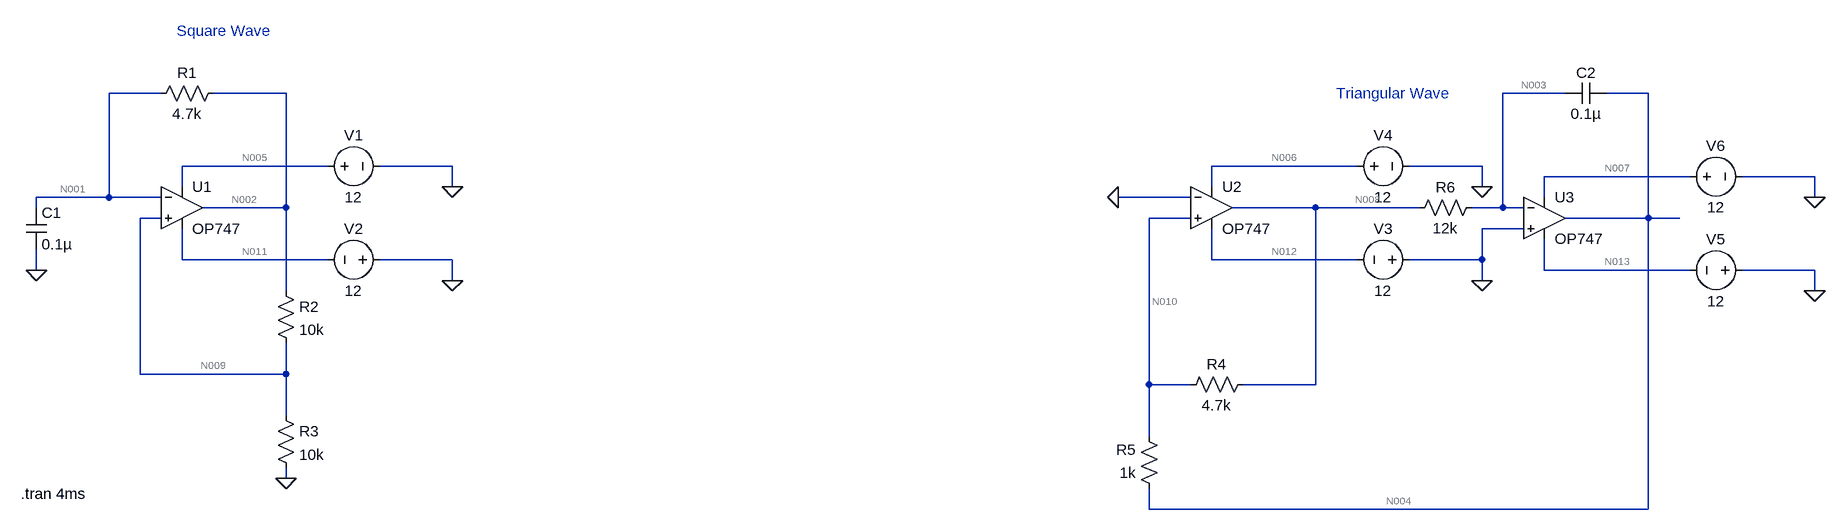
[diagram p0: schematic Square_wave_generator.asc]
Square_wave_generator.asc, the LTspice schematic file:
Version 4
SHEET 1 2580 680
WIRE 16 -64 -64 -64
WIRE 208 -64 96 -64
WIRE 2176 -64 2080 -64
WIRE 2304 -64 2240 -64
WIRE 272 48 48 48
WIRE 464 48 352 48
WIRE 1856 48 1632 48
WIRE 2048 48 1936 48
WIRE 2368 64 2144 64
WIRE 2560 64 2448 64
WIRE 48 80 48 48
WIRE 464 80 464 48
WIRE 1632 80 1632 48
WIRE 2048 80 2048 48
WIRE -64 96 -64 -64
WIRE -64 96 -176 96
WIRE 16 96 -64 96
WIRE 1600 96 1488 96
WIRE 2144 96 2144 64
WIRE 2560 96 2560 64
WIRE -176 112 -176 96
WIRE 208 112 208 -64
WIRE 208 112 80 112
WIRE 1792 112 1664 112
WIRE 1952 112 1792 112
WIRE 2080 112 2080 -64
WIRE 2080 112 2032 112
WIRE 2112 112 2080 112
WIRE 16 128 -16 128
WIRE 1600 128 1536 128
WIRE 2304 128 2304 -64
WIRE 2304 128 2176 128
WIRE 2352 128 2304 128
WIRE 2112 144 2048 144
WIRE 48 192 48 144
WIRE 272 192 48 192
WIRE 464 192 352 192
WIRE 1632 192 1632 144
WIRE 1856 192 1632 192
WIRE 2048 192 2048 144
WIRE 2048 192 1936 192
WIRE -176 208 -176 176
WIRE 2144 208 2144 160
WIRE 2368 208 2144 208
WIRE 2560 208 2448 208
WIRE 464 224 464 192
WIRE 2048 224 2048 192
WIRE 208 240 208 112
WIRE 2560 240 2560 208
WIRE -16 368 -16 128
WIRE 208 368 208 320
WIRE 208 368 -16 368
WIRE 1536 384 1536 128
WIRE 1600 384 1536 384
WIRE 1792 384 1792 112
WIRE 1792 384 1680 384
WIRE 208 432 208 368
WIRE 1536 464 1536 384
WIRE 208 528 208 512
WIRE 1536 576 1536 544
WIRE 2304 576 2304 128
WIRE 2304 576 1536 576
FLAG 464 80 0
FLAG 464 224 0
FLAG -176 208 0
FLAG 208 528 0
FLAG 2048 80 0
FLAG 2048 224 0
FLAG 1488 96 0
FLAG 2560 96 0
FLAG 2560 240 0
SYMBOL voltage 256 48 R270
WINDOW 0 32 56 VTop 2
WINDOW 3 -32 56 VBottom 2
WINDOW 123 0 0 Left 0
WINDOW 39 0 0 Left 0
SYMATTR InstName V1
SYMATTR Value 12
SYMBOL voltage 368 192 R90
WINDOW 0 -32 56 VBottom 2
WINDOW 3 32 56 VTop 2
WINDOW 123 0 0 Left 0
WINDOW 39 0 0 Left 0
SYMATTR InstName V2
SYMATTR Value 12
SYMBOL OpAmps\\OP747 48 48 R0
SYMATTR InstName U1
SYMBOL cap -192 112 R0
SYMATTR InstName C1
SYMATTR Value 0.1µ
SYMBOL res 112 -80 R90
WINDOW 0 0 56 VBottom 2
WINDOW 3 32 56 VTop 2
SYMATTR InstName R1
SYMATTR Value 4.7k
SYMBOL res 192 224 R0
SYMATTR InstName R2
SYMATTR Value 10k
SYMBOL res 192 416 R0
SYMATTR InstName R3
SYMATTR Value 10k
SYMBOL voltage 1952 192 R90
WINDOW 0 -32 56 VBottom 2
WINDOW 3 32 56 VTop 2
WINDOW 123 0 0 Left 0
WINDOW 39 0 0 Left 0
SYMATTR InstName V3
SYMATTR Value 12
SYMBOL OpAmps\\OP747 1632 48 R0
SYMATTR InstName U2
SYMBOL res 1696 368 R90
WINDOW 0 0 56 VBottom 2
WINDOW 3 32 56 VTop 2
SYMATTR InstName R4
SYMATTR Value 4.7k
SYMBOL res 1552 560 R180
WINDOW 0 36 76 Left 2
WINDOW 3 36 40 Left 2
SYMATTR InstName R5
SYMATTR Value 1k
SYMBOL res 2048 96 R90
WINDOW 0 0 56 VBottom 2
WINDOW 3 32 56 VTop 2
SYMATTR InstName R6
SYMATTR Value 12k
SYMBOL voltage 1840 48 R270
WINDOW 0 32 56 VTop 2
WINDOW 3 -32 56 VBottom 2
WINDOW 123 0 0 Left 0
WINDOW 39 0 0 Left 0
SYMATTR InstName V4
SYMATTR Value 12
SYMBOL voltage 2464 208 R90
WINDOW 0 -32 56 VBottom 2
WINDOW 3 32 56 VTop 2
WINDOW 123 0 0 Left 0
WINDOW 39 0 0 Left 0
SYMATTR InstName V5
SYMATTR Value 12
SYMBOL OpAmps\\OP747 2144 64 R0
SYMATTR InstName U3
SYMBOL voltage 2352 64 R270
WINDOW 0 32 56 VTop 2
WINDOW 3 -32 56 VBottom 2
WINDOW 123 0 0 Left 0
WINDOW 39 0 0 Left 0
SYMATTR InstName V6
SYMATTR Value 12
SYMBOL cap 2240 -80 R90
WINDOW 0 0 32 VBottom 2
WINDOW 3 32 32 VTop 2
SYMATTR InstName C2
SYMATTR Value 0.1µ
TEXT -200 552 Left 2 !.tran 4ms
TEXT 40 -160 Left 2 ;Square Wave
TEXT 1824 -64 Left 2 ;Triangular Wave

The netlist it stands for:
* Square_wave_generator.asc
V1 N005 0 12
V2 0 N011 12
XU1 N009 N001 N005 N011 N002 OP747  ; pins In+ In- V+ V- OUT
C1 N001 0 0.1µ
R1 N002 N001 4.7k
R2 N002 N009 10k
R3 N009 0 10k
V3 0 N012 12
XU2 N010 0 N006 N012 N008 OP747  ; pins In+ In- V+ V- OUT
R4 N008 N010 4.7k
R5 N004 N010 1k
R6 N003 N008 12k
V4 N006 0 12
V5 0 N013 12
XU3 0 N003 N007 N013 N004 OP747  ; pins In+ In- V+ V- OUT
V6 N007 0 12
C2 N004 N003 0.1µ
.tran 4ms
* Square Wave
* Triangular Wave
.backanno
.end

* Results of the author's LTspice run, read from the files saved beside the schematic
* Operating Point, zero values left out:
*   V(n005) = 12 V
*   V(n011) = -12 V
*   V(n001) = 228.1 µV
*   V(n009) = 148.1 µV
*   V(n002) = 185.4 µV
*   V(n012) = -12 V
*   V(n006) = 12 V
*   V(n010) = -80 µV
*   V(n008) = -28.82 µV
*   V(n004) = -102 µV
*   V(n003) = 80 µV
*   V(n013) = -12 V
*   V(n007) = 12 V
*   I(R1) = -9.068 nA
*   I(R2) = 3.738 nA
*   I(R3) = 14.81 nA
*   I(R4) = 10.89 nA
*   I(R5) = -21.96 nA
*   I(R6) = 9.068 nA
*   I(V1) = -282.8 µA
*   I(V2) = -282.8 µA
*   I(V3) = -282.8 µA
*   I(V4) = -282.8 µA
*   I(V5) = -282.8 µA
*   I(V6) = -282.8 µA
*   Ix(u1:1) = -11.07 nA
*   Ix(u1:2) = -9.068 nA
*   Ix(u1:99) = 282.8 µA
*   Ix(u1:50) = -282.8 µA
*   Ix(u1:45) = 5.33 nA
*   Ix(u2:1) = -11.07 nA
*   Ix(u2:2) = -9.068 nA
*   Ix(u2:99) = 282.8 µA
*   Ix(u2:50) = -282.8 µA
*   Ix(u2:45) = -1.822 nA
*   Ix(u3:1) = -11.07 nA
*   Ix(u3:2) = -9.068 nA
*   Ix(u3:99) = 282.8 µA
*   Ix(u3:50) = -282.8 µA
*   Ix(u3:45) = 21.96 nA
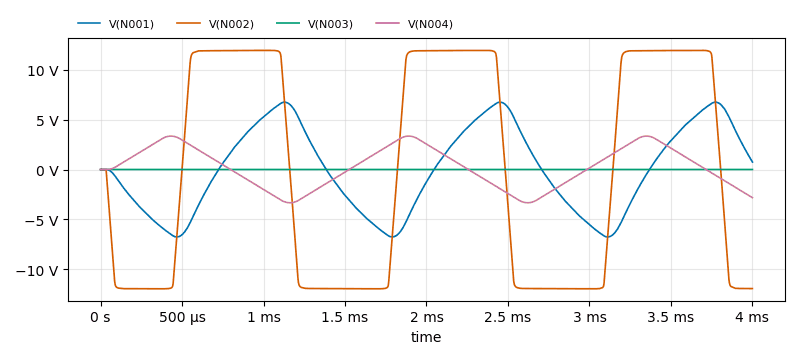
[diagram p1: Transient Analysis of Square_wave_generator.asc, plotted from the saved traces]
* Transient Analysis, 1 run:
*   V(N001): min -6.768 V, max 6.753 V, average -11.77 mV, rms 4.361 V, last 755.1 mV
*   V(N002): min -11.97 V, max 11.96 V, average 77.47 mV, rms 11.13 V, last -11.95 V
*   V(N003): min -6.368 mV, max 6.11 mV, average 289.2 µV, rms 2.698 mV, last 2.352 mV
*   V(N004): min -3.339 V, max 3.356 V, average 234.4 mV, rms 2.036 V, last -2.826 V